# Altium schematic sheet project-light.SchDoc
size A4
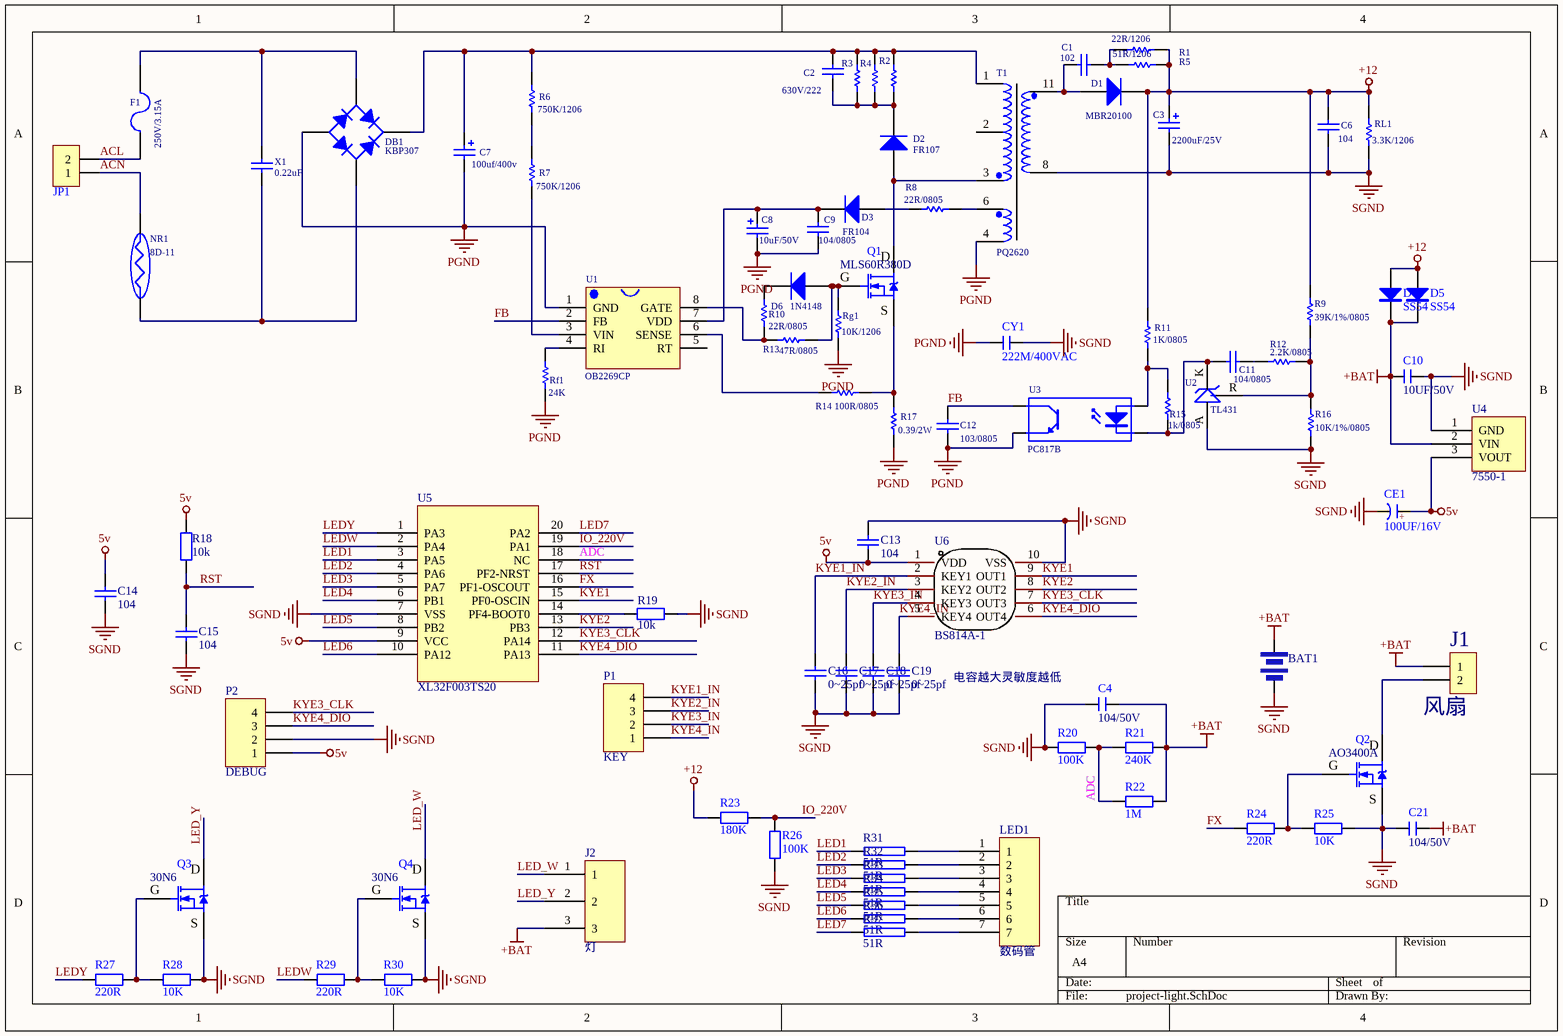
[diagram p0: project-light.SchDoc]

## Parts
BAT1  (no value)  [2pin]
C1  value 102  [C 1206_l]  (hidden comment: 472)
C2  630V/222  [CBB=7.5MM]
C3  2200uF/25V  [CAP 5.0*10*20-H - GD]
C4  104/50V  [C 0805_L]
C6  104  [C 1206_l]
C7  100uf/400v  [Cin /400V/56uF Wo]
C8  value 10uF/50V  [C Φ5*11 L=2.5]  (hidden comment: 47uF/50V)
C9  104/0805  [C 0805_L]
C10  10UF/50V  [C 0805_L]
C11  104/0805  [C 0805_L]
C12  103/0805  [C 0805_L]
C13  104  [c 0805_l]
C14  104  [C 0805_L]
C15  104  [C 0805_L]
C16  0~25pf  [C 0805_L]
C17  0~25pf  [C 0805_L]
C18  0~25pf  [C 0805_L]
C19  0~25pf  [C 0805_L]
C21  104/50V  [C 0805_L]
CE1  100UF/16V  [CAP 2.5*6.3*11.2]
CY1  222M/400VAC  [CY 7.5*8*4]
D1  MBR20100  [TO252]
D2  FR107  [D/SOD123]
D3  FR104  [D/SOD123]
D4  SS54  [SMA]
D5  SS54  [SMA]
D6  1N4148  [D 1N4148]
DB1  KBP307  [DB D=1.1MM]
F1  250V/3.15A  [F 3.15A L=5MM]
J1  风扇  [XH2.54-LI-2P]
J2  灯  [HDR2.54-LI-3P]
JP1  HDR-1X2  [AC-027母座]  (value not drawn)
LED1  数码管  [1516数码管]
NR1  8D-11  [NTC=7.5mm]
P1  KEY  [HDR1X4]
P2  DEBUG  [HDR1X4]
Q1  MLS60R380D  [TO252]
Q2  AO3400A  [SOT-23]
Q3  30N6  [TO252]
Q4  30N6  [TO252]
R1  51R/1206  [r 1206_l]
R2  50K/2510/1W  [R 1206_L]  (value not drawn)
R3  50K/2510/1W  [R 1206_L]  (value not drawn)
R4  50K/2510/1W  [R 1206_L]  (value not drawn)
R5  22R/1206  [r 1206_l]
R6  750K/1206  [R 1206_L]
R7  750K/1206  [R 1206_L]
R8  22R/0805  [R 0805_L]
R9  39K/1%/0805  [R 0805_L]
R10  22R/0805  [R 0805_L]
R11  1K/0805  [R 0805_L]
R12  2.2K/0805  [R 0805_L]
R13  47R/0805  [R 0805_L]
R14  100R/0805  [R 0805_L]
R15  1k/0805  [R 0805_L]
R16  value 10K/1%/0805  [R 0805_L]  (hidden comment: 12.5K/1%/0805)
R17  0.39/2W  [R 2512_L]
R18  10k  [R 0805_L]
R19  10k  [R 0805_L]
R20  100K  [R 0805_L]
R21  240K  [R 0805_L]
R22  1M  [R 0805_L]
R23  180K  [R 0805_L]
R24  220R  [R 0805_L]
R25  10K  [R 0805_L]
R26  100K  [R 0805_L]
R27  220R  [R 0805_L]
R28  10K  [R 0805_L]
R29  220R  [R 0805_L]
R30  10K  [R 0805_L]
R31  51R  [R 0805_L]
R32  51R  [R 0805_L]
R33  51R  [R 0805_L]
R34  51R  [R 0805_L]
R35  51R  [R 0805_L]
R36  51R  [R 0805_L]
R37  51R  [R 0805_L]
Rf1  value 24K  [R 0805_L]  (hidden comment: Res1)
Rg1  value 10K/1206  [R 1206_L]  (hidden comment: 10K/0805)
RL1  3.3K/1206  [r 1206_l]
T1  PQ2620  [T PQ2620]
U1  OB2269CP  [OB2269]
U2  TL431  [LC-SOT-23(SOT-23-3)]
U3  PC817B  [LC-SMD-4]
U4  7550-1  [SOT-89]
U5  XL32F003TS20  [TSSOP20]
U6  BS814A-1  [MSOP-10]
X1  value 0.22uF  [CX=10mm]  (hidden comment: 224)

## Nets
5v: C13.2 C14.1 CE1.1(A) P2.1 R18.2 U4.3(VOUT) U5.9(VCC) U6.1(VDD)
+12: C3.1 C6.1 D1.2(K) D4.1(A) D5.1(A) R1.1 R5.1 R9.2 R11.2 R23.2 RL1.2
+BAT: BAT1.1 C4.1 C10.2 C21.2 D4.2(K) D5.2(K) J1.1 J2.3 R21.1 R22.2 U4.2(VIN)
PGND: C7.2 C8.2 C9.2 C12.1 CY1.2 DB1.- R17.1 Rf1.2 Rg1.2 T1.4 U1.1(GND) U3.E
SGND: BAT1.2 C3.2 C4.2 C6.2 C10.1 C13.1 C14.2 C15.2 C16.1 C17.1 C18.1 C19.1 C21.1 CE1.2(K) CY1.1 P2.2 Q2.2(S) Q3.3(S) Q4.3(S) R16.1 R19.1 R20.2 R25.1 R26.1 R28.1 R30.1 RL1.1 T1.8 U2.A U4.1(GND) U5.7(VSS) U6.10(VSS)
ACL: F1.1 JP1.2
ACN: JP1.1 NR1.1
ADC: R20.1 R21.2 R22.1 U5.18(NC)
FB: C12.2 U1.2(FB) U3.C
FX: R24.2 U5.16(PF1-OSCOUT)
IO_220V: R23.1 R26.2 U5.19(PA1)
KYE1: U5.15(PF0-OSCIN) U6.9(OUT1)
KYE1_IN: C16.2 P1.4 U6.2(KEY1)
KYE2: U5.13(PB3) U6.8(OUT2)
KYE2_IN: C17.2 P1.3 U6.3(KEY2)
KYE3_CLK: P2.4 U5.12(PA14) U6.7(OUT3)
KYE3_IN: C18.2 P1.2 U6.4(KEY3)
KYE4_DIO: P2.3 U5.11(PA13) U6.6(OUT4)
KYE4_IN: C19.2 P1.1 U6.5(KEY4)
LED1: R31.2 U5.3(PA5)
LED2: R32.2 U5.4(PA6)
LED3: R33.2 U5.5(PA7)
LED4: R34.2 U5.6(PB1)
LED5: R35.2 U5.8(PB2)
LED6: R36.2 U5.10(PA12)
LED7: R37.2 U5.20(PA2)
LED_W: J2.1 Q4.2(D)
LED_Y: J2.2 Q3.2(D)
LEDW: R29.2 U5.2(PA4)
LEDY: R27.2 U5.1(PA3)
RST: C15.1 R18.1 U5.17(PF2-NRST)
NetC1_1: C1.1 D1.1(A) T1.11
NetC1_2: C1.2 R1.2 R5.2
NetC2_1: C2.1 C7.1 DB1.+ R2.1 R3.1 R4.1 R6.2 T1.1
NetC2_2: C2.2 D2.2(K) R2.2 R3.2 R4.2
NetC8_1: C8.1 C9.1 D3.2(K) U1.7(VDD)
NetC11_1: C11.1 R15.1 U2.K U3.K
NetC11_2: C11.2 R12.2
NetD2_1: D2.1(A) Q1.2(D) T1.3
NetD3_1: D3.1(A) R8.2
NetD6_+: D6.+(A) Q1.1(G) R13.1 Rg1.1
NetD6_-: D6.-(K) R10.1
NetDB1_L: DB1.L F1.2 X1.2
NetDB1_N: DB1.N NR1.2 X1.1
NetJ1_2: J1.2 Q2.3(D)
NetLED1_1: LED1.1 R31.1
NetLED1_2: LED1.2 R32.1
NetLED1_3: LED1.3 R33.1
NetLED1_4: LED1.4 R34.1
NetLED1_5: LED1.5 R35.1
NetLED1_6: LED1.6 R36.1
NetLED1_7: LED1.7 R37.1
NetQ1_3: Q1.3(S) R14.1 R17.2
NetQ2_1: Q2.1(G) R24.1 R25.2
NetQ3_1: Q3.1(G) R27.1 R28.2
NetQ4_1: Q4.1(G) R29.1 R30.2
NetR6_1: R6.1 R7.2
NetR7_1: R7.1 U1.3(VIN)
NetR8_1: R8.1 T1.6
NetR9_1: R9.1 R12.1 R16.2 U2.R
NetR10_2: R10.2 R13.2 U1.8(GATE)
NetR11_1: R11.1 R15.2 U3.A
NetR14_2: R14.2 U1.6(SENSE)
NetR19_2: R19.2 U5.14(PF4-BOOT0)
NetRf1_1: Rf1.1 U1.4(RI)

Not connected (* = marked no-connect by the designer): T1 2; U1 5(RT)

## Notes on the sheet
- 电容越大灵敏度越低
- (in symbol CE) +

## Library data of the parts
BAT1 = BATTERY
C1 C6 C11 C12 X1 = Cap: Capacitor; Published: 8-Jun-2000; LatestRevisionDate: 17-Jul-2002; LatestRevisionNote: Re-released for DXP Platform.; PackageReference: RAD-0.3; Publisher: Altium Limited; PackageDescription: Radial Cap, Thru-Hole; 2 Leads; 0.3 in Pin Spacing
  C6: Value: 104
  C11: Value: 104/0805
  C12: Value: 103/0805
C2 = Cap: Capacitor; Value: 1000V103; Published: 8-Jun-2000; LatestRevisionDate: 17-Jul-2002; LatestRevisionNote: Re-released for DXP Platform.; PackageReference: RAD-0.3; Publisher: Altium Limited; PackageDescription: Radial Cap, Thru-Hole; 2 Leads; 0.3 in Pin Spacing
C3 C7 C8 = Cap Pol2: Polarized Capacitor (Axial); Published: 8-Jun-2000; LatestRevisionDate: 17-Jul-2002; LatestRevisionNote: Re-released for DXP Platform.; PackageReference: POLAR0.8; Publisher: Altium Limited; PackageDescription: Polarized Capacitor; 2 Leads
  C3: Value: 2200uF/25V
C4 C10 C21 = CC: 瓷片电容; BOM名称: 直插瓷片电容; 淘宝ID: 封装库来自淘宝 ID：黄晶宝石; 封装库来自淘宝卖家 ID：黄晶宝石: 其他店铺购入均为盗版，不享受售后技术支持服务，请立即申请退款; 联系售后: https://shop463601444.taobao.com
C9 = Cap: Capacitor; Value: 104/1206; Published: 8-Jun-2000; LatestRevisionDate: 17-Jul-2002; LatestRevisionNote: Re-released for DXP Platform.; PackageReference: RAD-0.3; Publisher: Altium Limited; PackageDescription: Radial Cap, Thru-Hole; 2 Leads; 0.3 in Pin Spacing
C13-C19 = Cap: Capacitor; Value: 100pF; Published: 8-Jun-2000; LatestRevisionDate: 17-Jul-2002; LatestRevisionNote: Re-released for DXP Platform.; PackageReference: RAD-0.3; Publisher: Altium Limited
CE1 = CE: 直插电解电容; 淘宝ID: 封装库来自淘宝 ID：黄晶宝石; BOM名称: 直插电解电容; 联系售后: https://shop463601444.taobao.com
CY1 = CY: 安规Y电容; BOM名称: 高压陶瓷电容，Y电容; 版权归属: 封装库来自淘宝 ID：黄晶宝石; 联系售后: https://shop463601444.taobao.com
D1-D3 D6 = Diode BAS116: Silicon Low Leakage Diode; Note: Pin 2 is not connected and not drawn.; Published: 21-Mar-2003; LatestRevisionDate: 29-May-2009; LatestRevisionNote: IPC-7351 Footprint Added.; DatasheetVersion: Oct-1999; PackageVersion: Sep-2001; PackageReference: SOT-23; Publisher: Altium Limited; PackageDescription: 3-Pin SOT-23 Package 0.95 mm Pitch, 2.5 mm Lead Span; ComponentLink1Description: Manufacturer Link; ComponentLink1URL: http://www.infineon.com/; ComponentLink2Description: Datasheet; ComponentLink2URL: http://www.infineon.com/upload/Document/cmc_upload/documents/080/656/bas116series.pdf
D4 D5 = 1N4007: 整流二极管; 淘宝ID: 封装库来自淘宝 ID：黄晶宝石; 封装库来自淘宝卖家 ID：黄晶宝石: 其他店铺购入均为盗版，不享受售后技术支持服务，请立即申请退款; BOM名称: 整流二极管; 联系售后，技术支持: https://shop463601444.taobao.com
DB1 = Bridge1: Full Wave Diode Bridge; Published: 8-Jun-2000; LatestRevisionDate: 29-May-2009; LatestRevisionNote: Sch pins A & K swapped.; DatasheetVersion: E2732B; PackageReference: D-38; Publisher: Altium Limited; PackageDescription: Bridge Rectifier; 4 Terminals; Body 9.4 x 9.4 mm (typ); Pitch 5.08 mm
F1 = Fuse 2: Fuse; Published: 8-Jun-2000; LatestRevisionDate: 17-Jul-2002; LatestRevisionNote: Re-released for DXP Platform.; PackageReference: PIN-W2/E2.8; Publisher: Altium Limited; PackageDescription: Thru-Hole; 2 Leads
J1 = CON2: Connector
J2 = Component_1
JP1 = Header 2: 2P接插件; 版权归属: 封装库来自淘宝 ID：黄晶宝石; BOM名称: 2P接插件; 技术支持，联系售后: https://shop463601444.taobao.com
NR1 = NTC
P1 P2 = Header 4: Header, 4-Pin; LatestRevisionDate: 17-Jul-2002; LatestRevisionNote: Re-released for DXP Platform.; Publisher: Altium Limited
Q1-Q4 = IRF840: N沟场效应管; BOM名称: N沟场效应管; 技术支持，联系售后: https://shop463601444.taobao.com
R1 = Res1: Resistor; Value: 68R/1206; Published: 8-Jun-2000; LatestRevisionDate: 17-Jul-2002; LatestRevisionNote: Re-released for DXP Platform.; PackageReference: AXIAL-0.3; Publisher: Altium Limited; PackageDescription: Axial Device, Thru-Hole; 2 Leads; 0.3 in Pin Spacing
R2-R4 = Res1: Resistor; Value: 100K/2W; Published: 8-Jun-2000; LatestRevisionDate: 17-Jul-2002; LatestRevisionNote: Re-released for DXP Platform.; PackageReference: AXIAL-0.3; Publisher: Altium Limited; PackageDescription: Axial Device, Thru-Hole; 2 Leads; 0.3 in Pin Spacing
R5 = Res1: Resistor; Value: 47R/1206; Published: 8-Jun-2000; LatestRevisionDate: 17-Jul-2002; LatestRevisionNote: Re-released for DXP Platform.; PackageReference: AXIAL-0.3; Publisher: Altium Limited; PackageDescription: Axial Device, Thru-Hole; 2 Leads; 0.3 in Pin Spacing
R6-R9 R15 R16 Rf1 Rg1 = Res1: Resistor; Published: 8-Jun-2000; LatestRevisionDate: 17-Jul-2002; LatestRevisionNote: Re-released for DXP Platform.; PackageReference: AXIAL-0.3; Publisher: Altium Limited; PackageDescription: Axial Device, Thru-Hole; 2 Leads; 0.3 in Pin Spacing
  R6 R7: Value: 750K/1206
  R9: Value: 39K/1%/0805
  R15: Value: 1k/0805
R10 = Res1: Resistor; Value: 30R/1206; Published: 8-Jun-2000; LatestRevisionDate: 17-Jul-2002; LatestRevisionNote: Re-released for DXP Platform.; PackageReference: AXIAL-0.3; Publisher: Altium Limited; PackageDescription: Axial Device, Thru-Hole; 2 Leads; 0.3 in Pin Spacing
R11 = Res1: Resistor; Value: 470/0805; Published: 8-Jun-2000; LatestRevisionDate: 17-Jul-2002; LatestRevisionNote: Re-released for DXP Platform.; PackageReference: AXIAL-0.3; Publisher: Altium Limited; PackageDescription: Axial Device, Thru-Hole; 2 Leads; 0.3 in Pin Spacing
R12 = Res1: Resistor; Value: 200/0805; Published: 8-Jun-2000; LatestRevisionDate: 17-Jul-2002; LatestRevisionNote: Re-released for DXP Platform.; PackageReference: AXIAL-0.3; Publisher: Altium Limited; PackageDescription: Axial Device, Thru-Hole; 2 Leads; 0.3 in Pin Spacing
R13 = Res1: Resistor; Value: /47R/1206; Published: 8-Jun-2000; LatestRevisionDate: 17-Jul-2002; LatestRevisionNote: Re-released for DXP Platform.; PackageReference: AXIAL-0.3; Publisher: Altium Limited; PackageDescription: Axial Device, Thru-Hole; 2 Leads; 0.3 in Pin Spacing
R14 = Res1: Resistor; Value: 390/1206; Published: 8-Jun-2000; LatestRevisionDate: 17-Jul-2002; LatestRevisionNote: Re-released for DXP Platform.; PackageReference: AXIAL-0.3; Publisher: Altium Limited; PackageDescription: Axial Device, Thru-Hole; 2 Leads; 0.3 in Pin Spacing
R17 = Res1: 合金电阻; Published: 8-Jun-2000; LatestRevisionDate: 17-Jul-2002; LatestRevisionNote: Re-released for DXP Platform.; PackageReference: AXIAL-0.3; Publisher: Altium Limited; PackageDescription: Axial Device, Thru-Hole; 2 Leads; 0.3 in Pin Spacing
R18 R19 = Res2: Resistor; Value: 1K; Published: 8-Jun-2000; LatestRevisionDate: 17-Jul-2002; LatestRevisionNote: Re-released for DXP Platform.; PackageReference: AXIAL-0.4; Publisher: Altium Limited
R20-R30 = R-S: 色环电阻; 版权归属: 封装库来自淘宝 ID：黄晶宝石; BOM名称: 色环电阻; 联系售后: https://shop463601444.taobao.com
R31-R37 = RES2
RL1 = Res1: Resistor; Value: 750K/1206; Published: 8-Jun-2000; LatestRevisionDate: 17-Jul-2002; LatestRevisionNote: Re-released for DXP Platform.; PackageReference: AXIAL-0.3; Publisher: Altium Limited; PackageDescription: Axial Device, Thru-Hole; 2 Leads; 0.3 in Pin Spacing
T1 = T
U3 = Optoisolator1: 4-Pin Phototransistor Optocoupler; Published: 24-Mar-1999; LatestRevisionDate: 04-Mar-2005; LatestRevisionNote: Sch pins 3 & 4 Swapped.; DatasheetVersion: Nov-2003; PackageReference: DIP-4; Publisher: Altium Limited
U5 = XL32F003
U6 = BS814A-1: Manufacturer: HOLTEK(合泰/盛群); Add into BOM: yes; Name: BS814A-1; Symbol: BS814A-1; Device: BS814A-1; LCSC Part Name: BS814A-1; Supplier Part: C81746; Manufacturer Part: BS814A-1; Supplier Footprint: MSOP-10; JLCPCB Part Class: 扩展库; Datasheet: https://www.holtek.com/documents/10179/116711/BS81xA-xv160.pdf; Supplier: LCSC; Convert to PCB: yes